# Altium schematic sheet Main.SchDoc
size A3; SheetNumber: 1; SheetTotal: 4
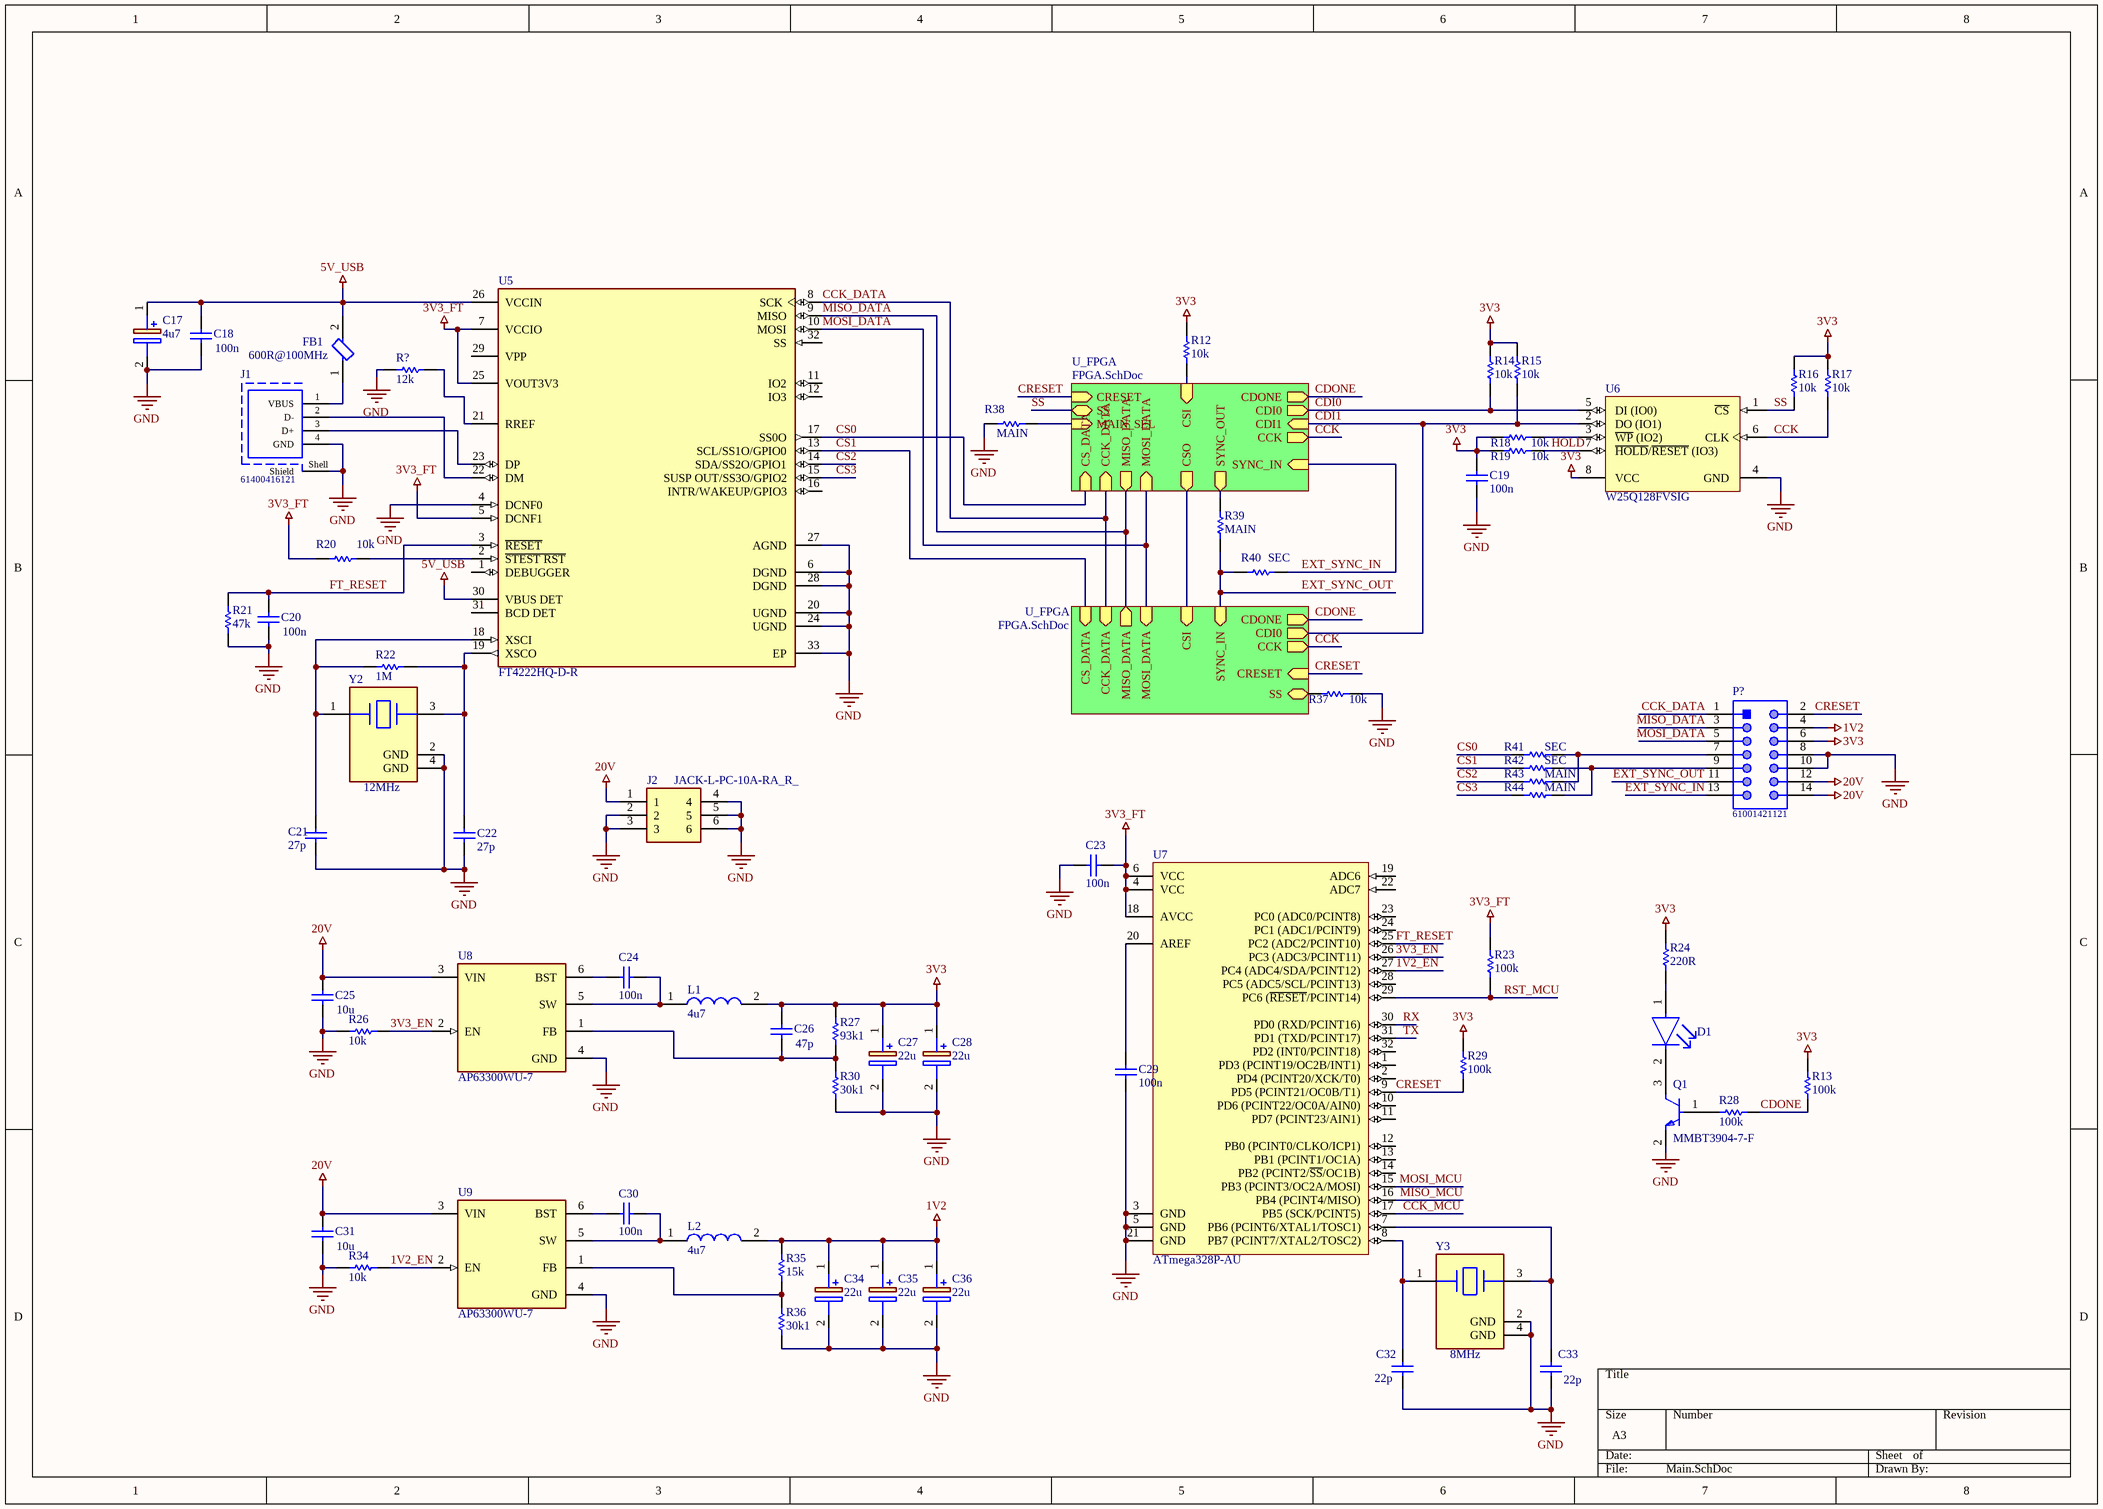
[diagram p0: Main.SchDoc]

## Parts
C17  4u7  [865080640004]
C18  100n  [SAMS-C0603-2_M]
C19  100n  [SAMS-C0603-2_M]
C20  100n  [SAMS-C0603-2_M]
C21  27p  [SAMS-C0603-2_M]
C22  27p  [SAMS-C0603-2_M]
C23  100n  [SAMS-C0603-2_M]
C24  100n  [SAMS-C0603-2_M]
C25  10u  [SAMS-C0603-2_M]
C26  47p  [SAMS-C0603-2_M]
C27  22u  [CAPAE430X550N]
C28  22u  [CAPAE430X550N]
C29  100n  [SAMS-C0603-2_M]
C30  100n  [SAMS-C0603-2_M]
C31  10u  [SAMS-C0603-2_M]
C32  22p  [SAMS-C0603-2_M]
C33  22p  [SAMS-C0603-2_M]
C34  22u  [CAPAE430X550N]
C35  22u  [CAPAE430X550N]
C36  22u  [CAPAE430X550N]
D1  (no value)  [FP-APT2012MGC-MFG]
FB1  600R@100MHz  [FP-MH1608-MFG]
J1  61400416121  [61400416121]
J2  JACK-L-PC-10A-RA_R_  [JACKLPC10ARAR]
L1  4u7  [SRP05204R7K]
L2  4u7  [SRP05204R7K]
P?  61001421121  [61001421121]
Q1  MMBT3904-7-F  [FP-SOT23-IPC_A]
R12  10k  [RESC1609X55X30LL15T15]
R13  100k  [RESC1609X55X30LL15T15]
R14  10k  [RESC1609X55X30LL15T15]
R15  10k  [RESC1609X55X30LL15T15]
R16  10k  [RESC1609X55X30LL15T15]
R17  10k  [RESC1609X55X30LL15T15]
R18  10k  [RESC1609X55X30LL15T15]
R19  10k  [RESC1609X55X30LL15T15]
R20  10k  [RESC1609X55X30LL15T15]
R21  47k  [RESC1609X55X30LL15T15]
R22  1M  [RESC1609X55X30LL15T15]
R23  100k  [RESC1609X55X30LL15T15]
R24  220R  [RESC1609X55X30LL15T15]
R26  10k  [RESC1609X55X30LL15T15]
R27  93k1  [RESC1609X55X30LL15T15]
R28  100k  [RESC1609X55X30LL15T15]
R29  100k  [RESC1609X55X30LL15T15]
R30  30k1  [RESC1609X55X30LL15T15]
R34  10k  [RESC1609X55X30LL15T15]
R35  15k  [RESC1609X55X30LL15T15]
R36  30k1  [RESC1609X55X30LL15T15]
R37  10k  [RESC1609X55X30LL15T15]
R38  MAIN  [RESC1005X40X20NL05T10]
R39  MAIN  [RESC1005X40X20NL05T10]
R40  SEC  [RESC1005X40X20NL05T10]
R41  SEC  [RESC1005X40X20NL05T10]
R42  SEC  [RESC1005X40X20NL05T10]
R43  MAIN  [RESC1005X40X20NL05T10]
R44  MAIN  [RESC1005X40X20NL05T10]
R?  12k  [RESC1609X55X30LL15T15]
U5  FT4222HQ-D-R  [FP-VQFN-32-MFG]
U6  W25Q128FVSIG  [WINB-SOIC-8_M]
U7  ATmega328P-AU  [32A_M]
U8  AP63300WU-7  [FP-TSOT26-IPC_A]
U9  AP63300WU-7  [FP-TSOT26-IPC_A]
Y2  12MHz  [FP-ABM3B-MFG]
Y3  8MHz  [FP-ABM3B-MFG]

## Sub-sheets
U_FPGA = FPGA.SchDoc: CDONE (out), CRESET (in), CDI1 (in), CDI0 (out), CCK (out), SS (bidir), MAIN_SEL (in), SYNC_OUT (out), SYNC_IN (in), CSI (in), CSO (out), CS_DATA (in), CCK_DATA (in), MISO_DATA (out), MOSI_DATA (in)
U_FPGA = FPGA.SchDoc: CDONE (out), CRESET (in), CDI0 (out), CCK (out), SS (bidir), SYNC_IN (in), CSI (in), MOSI_DATA (in), MISO_DATA (out), CCK_DATA (in), CS_DATA (in)

## Nets
1V2: C34.1(+) C35.1(+) C36.1(+) L2.2 P?.4 R35.2
3V3: C19.2 C26.1 C27.1(+) C28.1(+) L1.2 P?.6 R12.2 R13.1 R14.2 R15.2 R16.2 R17.2 R18.1 R19.1 R24.2 R27.2 R29.2 U6.8(VCC)
3V3_FT: C23.2 R20.1 R23.2 U5.5(DCNF1) U5.7(VCCIO) U5.25(VOUT3V3) U7.4(VCC) U7.6(VCC) U7.18(AVCC)
5V_USB: C17.1(+) C18.1 FB1.2 U5.26(VCCIN) U5.30(VBUS_DET)
20V: C25.1 C31.1 J2.1 P?.12 P?.14 U8.3(VIN) U9.3(VIN)
GND: C17.2(-) C18.2 C19.1 C20.2 C21.1 C22.1 C23.1 C25.2 C27.2(-) C28.2(-) C29.1 C31.2 C32.1 C33.1 C34.2(-) C35.2(-) C36.2(-) J1.4(GND) J1.Shell(Shield) J2.2 J2.3 J2.4 J2.5 J2.6 P?.8 P?.10 Q1.2(E) R21.1 R26.1 R30.1 R34.1 R36.1 R37.2 R38.2 R?.2 U5.4(DCNF0) U5.6(DGND) U5.20(UGND) U5.24(UGND) U5.27(AGND) U5.28(DGND) U5.33(EP) U6.4(GND) U7.3(GND) U7.5(GND) U7.21(GND) U8.4(GND) U9.4(GND) Y2.2(GND) Y2.4(GND) Y3.2(GND) Y3.4(GND)
1V2_EN: R34.2 U7.27(PC4_(ADC4/SDA/PCINT12)) U9.2(EN)
3V3_EN: R26.2 U7.26(PC3_(ADC3/PCINT11)) U8.2(EN)
CCK: R17.1 U6.6(CLK) ; sheet U_FPGA/CCK, sheet U_FPGA/CCK
CCK_DATA: P?.1 U5.8(SCK) ; sheet U_FPGA/CCK_DATA, sheet U_FPGA/CCK_DATA
CCK_MCU: U7.17(PB5_(SCK/PCINT5))
CDI0: R14.1 U6.5(DI_(IO0)) ; sheet U_FPGA/CDI0
CDI1: R15.1 U6.2(DO_(IO1)) ; sheet U_FPGA/CDI1, sheet U_FPGA/CDI0
CDONE: R13.2 R28.1 ; sheet U_FPGA/CDONE, sheet U_FPGA/CDONE
CRESET: P?.2 R29.1 U7.9(PD5_(PCINT21/OC0B/T1)) ; sheet U_FPGA/CRESET, sheet U_FPGA/CRESET
CS0: R41.2 U5.17(SS0O) ; sheet U_FPGA/CS_DATA
CS1: R42.2 U5.13(SCL/SS1O/GPIO0) ; sheet U_FPGA/CS_DATA
CS2: R43.2 U5.14(SDA/SS2O/GPIO1)
CS3: R44.2 U5.15(SUSP_OUT/SS3O/GPIO2)
EXT_SYNC_IN: P?.13 R40.1 ; sheet U_FPGA/SYNC_IN
EXT_SYNC_OUT: P?.11 R39.2 R40.2 ; sheet U_FPGA/SYNC_IN
FT_RESET: C20.1 R21.2 U5.3(~{RESET}) U7.25(PC2_(ADC2/PCINT10))
HOLD: R19.2 U6.7(~{HOLD}/~{RESET}_(IO3))
MISO_DATA: P?.3 U5.9(MISO) ; sheet U_FPGA/MISO_DATA, sheet U_FPGA/MISO_DATA
MISO_MCU: U7.16(PB4_(PCINT4/MISO))
MOSI_DATA: P?.5 U5.10(MOSI) ; sheet U_FPGA/MOSI_DATA, sheet U_FPGA/MOSI_DATA
MOSI_MCU: U7.15(PB3_(PCINT3/OC2A/MOSI))
RST_MCU: R23.1 U7.29(PC6_(~{RESET}/PCINT14))
RX: U7.30(PD0_(RXD/PCINT16))
SS: R16.1 U6.1(~{CS}) ; sheet U_FPGA/SS
TX: U7.31(PD1_(TXD/PCINT17))
NetC21_2: C21.2 R22.1 U5.18(XSCI) Y2.1
NetC22_2: C22.2 R22.2 U5.19(XSCO) Y2.3
NetC24_1: C24.1 U8.6(BST)
NetC24_2: C24.2 L1.1 U8.5(SW)
NetC26_2: C26.2 R27.1 R30.2 U8.1(FB)
NetC29_2: C29.2 U7.20(AREF)
NetC30_1: C30.1 U9.6(BST)
NetC30_2: C30.2 L2.1 U9.5(SW)
NetC32_2: C32.2 U7.8(PB7_(PCINT7/XTAL2/TOSC2)) Y3.1
NetC33_2: C33.2 U7.7(PB6_(PCINT6/XTAL1/TOSC1)) Y3.3
NetD1_1: D1.1(A) R24.1
NetD1_2: D1.2(C) Q1.3(C)
NetFB1_1: FB1.1 J1.1(VBUS)
NetJ1_2: J1.2(D-) U5.22(DM)
NetJ1_3: J1.3(D+) U5.23(DP)
NetP?_7: P?.7 R41.1 R43.1
NetP?_9: P?.9 R42.1 R44.1
NetQ1_1: Q1.1(B) R28.2
NetR12_1: R12.1 ; sheet U_FPGA/CSI
NetR18_2: R18.2 U6.3(~{WP}_(IO2))
NetR20_2: R20.2 U5.2(~{STEST_RST})
NetR35_1: R35.1 R36.2 U9.1(FB)
NetR37_1: R37.1 ; sheet U_FPGA/SS
NetR38_1: R38.1 ; sheet U_FPGA/MAIN_SEL
NetR39_1: R39.1 ; sheet U_FPGA/SYNC_OUT
NetR?_1: R?.1 U5.21(RREF)
(unnamed): sheet U_FPGA/CSO, sheet U_FPGA/CSI

Not connected (* = marked no-connect by the designer): U5 1(DEBUGGER) 11(IO2) 12(IO3) 16(INTR/WAKEUP/GPIO3) 29(VPP) 31(BCD_DET) 32(SS); U7 1(PD3_(PCINT19/OC2B/INT1)) 2(PD4_(PCINT20/XCK/T0)) 10(PD6_(PCINT22/OC0A/AIN0)) 11(PD7_(PCINT23/AIN1)) 12(PB0_(PCINT0/CLKO/ICP1)) 13(PB1_(PCINT1/OC1A)) 14(PB2_(PCINT2/~{SS}/OC1B)) 19(ADC6) 22(ADC7) 23(PC0_(ADC0/PCINT8)) 24(PC1_(ADC1/PCINT9)) 28(PC5_(ADC5/SCL/PCINT13)) 32(PD2_(INT0/PCINT18))

## Library data of the parts
C17 = 865080640004: Capacitor Polarised; Manufacturer_Name: Wurth Elektronik; Datasheet Link: https://www.we-online.de/katalog/datasheet/865080640004.pdf; Height: 5.5mm; Manufacturer_Part_Number: 865080640004; Mouser Part Number: 710-865080640004; Mouser Price/Stock: https://www.mouser.co.uk/ProductDetail/Wurth-Elektronik/865080640004?qs=0KOYDY2FL2%2FjY4kqBxIvAg%3D%3D
C18-C26 C29-C33 = CMP-2000-05332-1: Multi-layer Ceramic Capacitor, -55 to 125 degC, 2-Pin SMD (0603), RoHS, Tape and Reel; Manufacturer: Samsung Electro-Mechanics; Capacitance: 0.1µF; Rated Voltage: 50V; Dielectric: X7R; Tolerance (%): ±10%; Case Size/Dimension: 0603; Datasheet URL: https://datasheet.ciiva.com/29198/456651-da-01-en-vs-kondensator-0605-29198839.pdf; Manufacturer URL: http://www.samsungsem.com/global/index.jsp; Datasheet Version: Nov-10
C27 C28 C34-C36 = 865080340003: Capacitor Polarised; Manufacturer_Name: Wurth Elektronik; Datasheet Link: http://uk.rs-online.com/web/p/products/1635695; Height: 5.5mm; Manufacturer_Part_Number: 865080340003; Mouser Part Number: 710-865080340003; Mouser Price/Stock: https://www.mouser.co.uk/ProductDetail/Wurth-Elektronik/865080340003?qs=0KOYDY2FL2%252BowmC4S50IuQ%3D%3D
D1 = CMP-44529-000017-1: LED GREEN CLEAR CHIP SMD; Power Rating: 75mW; Lens Color: Colorless; Luminous Intensity: 70mcd; Forward Current: 20mA; Dominant Wavelength: 570nm; Viewing Angle: 120°; Forward Voltage: 2.1V; Package Quantity: 2000; Color: Green; Length: 2mm; Lead Free: Lead Free; Min Operating Temperature: -40°C; Illumination Color: Green; Case/Package: 0805; Width: 1.25mm; Test Current: 20mA; Max Operating Temperature: 85°C; Case Code (Imperial): 0805; Mount: Surface Mount; Lens Style: Clear; Height: 0.75mm; Case Code (Metric): 2012; Packaging: Tape and Reel; Lens Transparency: Clear
FB1 = CMP-2000-06698-2: FERRITE BEAD 600 OHM 0603 1LN; Tolerance: 25%; Max DC Current: 1A; Test Frequency: 100MHz; Current Rating: 3A; Number of Lines: 1; DC Resistance (DCR): 25mR; Impedance: 600R; Case/Package: 0603; Packaging: Tape and Reel; Case Code (Imperial): 0603; Radiation Hardening: No; Package Quantity: 1; Height: 0.039inch; Width: 0.031inch; Series: MH; REACH SVHC: No SVHC; Depth: 1mm; Min Operating Temperature: -55°C; Length: 0.063inch; Case Code (Metric): 1608; Termination: SMD/SMT; RoHS Compliant: Yes; DC Current: 1A; Max Current Rating: 1A; Core Material: Ferrite; Mount: Surface Mount; Military Standard: Not; Max Operating Temperature: 125°C
J1 = CMP-1502-03243-1: USB 2.0 Type B Receptacle WR-COM, Horizontal, THT, with Pads and Pegs; Manufacturer: Wurth Elektronik; Contact Resistance: 20mOhm; Rated Current: 1.5A; Working Voltage: 30VAC; Package Reference: 61400416121; Part Number: 61400416121; Packaging: Tray; Mounting Technology: THT; Gender: Receptacle; Datasheet URL: https://katalog.we-online.de/em/datasheet/61400416121.pdf; Publisher: WurthElektronik; Orientation: Horizontal; Connector Type: USB2.0TypeB; Operating Temperature: -40to105degC; Manufacturer URL: http://www.we-online.de
J2 = JACK-L-PC-10A-RA_R_: Connector; Manufacturer_Name: GlobTek; Manufacturer_Part_Number: JACK-L-PC-10A-RA(R); Datasheet Link: https://www.globtek.com/pdf/manual-datasheets/JACK-L-PC-10A-RA%28R%29.pdf; Height: 10mm
L1 L2 = SRP0520-4R7K: Inductor; Manufacturer_Name: Bourns; Datasheet Link: http://www.bourns.com/docs/Product-Datasheets/SRP0520.pdf; Height: 2mm; Manufacturer_Part_Number: SRP0520-4R7K; Mouser Part Number: 652-SRP0520-4R7K; Mouser Price/Stock: https://www.mouser.co.uk/ProductDetail/Bourns/SRP0520-4R7K?qs=OlC7AqGiEDkW8f66KV8wEw%3D%3D; Arrow Part Number: SRP0520-4R7K; Arrow Price/Stock: https://www.arrow.com/en/products/srp0520-4r7k/bourns?region=nac
P? = CMP-1502-01031-1: SMT Vertical Pin Header WR-PHD, Pitch 2.54 mm, Dual Row, 14 pins; Manufacturer: Wurth Elektronik; Withstanding Voltage: 500VAC; Working Voltage: 250VAC; Contact Resistance: 20mOhm; Pitch: 2.54mm; Rated Current: 3A; Gender: Male; Pin Number: 14; Datasheet URL: https://katalog.we-online.de/em/datasheet/6100xx21121.pdf; Operating Temperature: -40to125degC; Manufacturer URL: http://www.we-online.de; Mounting Technology: SMT; Publisher: WurthElektronik; Packaging: Tube; Orientation: Vertical; Row Number: Dual; Part Number: 61001421121; Package Reference: 61001421121
Q1 = CMP-2000-04931-2: TRANS NPN 40V 0.2A SMD SOT23-3; Frequency: 300MHz; Power Dissipation: 350mW; Element Configuration: Single; Max Power Dissipation: 300mW; Max Collector Current: 200mA; Collector Emitter Saturation Voltage: 300mV; Number of Elements: 1; hFE Min: 100; Collector Base Voltage (VCBO): 60V; Emitter Base Voltage (VEBO): 6V; Contact Plating: Tin; Package Quantity: 3000; Max Frequency: 300MHz; REACH SVHC: No SVHC; Max Operating Temperature: 150°C; Width: 1.4mm; Collector Emitter Voltage (VCEO): 40V; Voltage Rating (DC): 40V; Radiation Hardening: No; Case/Package: SOT-23; Height: 1mm; Collector Emitter Breakdown Voltage: 40V; Length: 3.05mm; Polarity: NPN; Packaging: Tape and Reel; Number of Pins: 3; Min Operating Temperature: -55°C; Gain Bandwidth Product: 300MHz; Mount: Surface Mount; Weight: 0.000282oz; Continuous Collector Current: 200mA; Transition Frequency: 300MHz; Max Breakdown Voltage: 40V; Lead Free: Lead Free
R12-R24 R26-R30 R34-R37 R? = CMP-1012-00623-3: Chip Resistor, 10 KOhm, +/- 1%, 0.1 W, -55 to 155 degC, 0603 (1608 Metric), RoHS, Tape and Reel; Manufacturer: Panasonic; Voltage Rating: 75V; Case\/Package: 0603; Power Rating: 100mW; Resistance: 10KOhm; Temperature Coefficient: 100ppm\/degreesC; Number of Pins: 2; Package Reference: 603; Depth: 0.8mm; Mount: SurfaceMount; Package Description: 2-Pin Surface Mount Device, Body 1.6 x 0.85 mm; Datasheet Version: 02/2017; Length: 1.6mm; Lead Free: LeadFree; Height: 0.45mm; Number of Terminations: 2; Max Power Dissipation: 100mW; Min Operating Temperature: -55degC; Datasheet URL: https://industrial.panasonic.com/cdbs/www-data/pdf/RDA0000/AOA0000C304.pdf; Termination: SMD/SMT; Case Code (Metric): 1608; Case Code (Imperial): 0603; Tolerance: 1%; Max Operating Temperature: 155degC; RoHSCompliant: true; Voltage Rating (DC): 75V; Radiation Hardening: No; Packaging: TapeandReel; Composition: ThickFilm; Mounting Technology: SurfaceMount; Manufacturer URL: http://www.panasonic.com/; Width: 0.031inch; REACH SVHC: NoSVHC; Contact Plating: Tin; Military Standard: Not; Package Quantity: 1
R38-R44 = CMP-2002-01682-1: Manufacturer: Vishay BCcomponents; Part Number: TNPW040210K0DEED
U5 = CMP-194822-000008-1: IC BRIDGE USB TO I2C/SPI 32VQFN; Interface: I2C; Operating Supply Current: 78mA; Case/Package: VQFN; Max Operating Temperature: 85°C; Min Operating Temperature: -40°C; Packaging: Tape and Reel
U6 = CMP-2000-05005-1: 3V 128M-Bit Serial Flash Memory with Dual/Quad SPI & QPI, 2.7 to 3.6 V, -40 to 85 degC, 8-Pin SOIC, RoHS, Tape and Reel; Manufacturer: Winbond; Number of Words: 16777216; Address Bus: 24b; Word Size: 8b; Boot Type: NotRequired; Supply Current: 20mA; Operating Supply Voltage (Max): 3.6V; Sync/Async: Synchronous; Rad Hardened: No; Interface Type: Serial(SPI); Access Time (Max): 7ns; Operating Supply Voltage (Min): 2.7V; Operating Supply Voltage (Typ): 3/3.3V; Programmable: Yes; Density: 134217728Bit; Cell Type: NOR; Package Description: 8-Pin Small Outline Integrated Circuit, Body 5.28 x 5.28 mm, Pitch 1.27 mm; Datasheet URL: http://download.siliconexpert.com/pdfs/2015/11/30/6/42/17/890/win_/manual/3w25q128fv20rev.l2008242015.pdf; Package Reference: SS-8; Package Type: SOICW; Datasheet Version: Rev. L, 08/2015; Manufacturer URL: http://www.winbond.com/hq/index.html?__locale=en; Pin Count: 8; Operating Temperature Classification: Industrial; Operating Temperature (Min): -40C; Program/Erase Volt (Typ): 2.7to3.6V; Operating Temperature (Max): 85C; Mounting: SurfaceMount; Operating Temp Range: -40Cto85C
U7 = CMP-0095-00269-2: 8-bit AVR Microcontroller, 32KB Flash, 1KB EEPROM, 2KB SRAM, 32-pin TQFP, Industrial Grade (-40°C to 85°C); PackageDescription: 32-Lead, 7x7x1.0 mm Body, 0.8mm Lead Pitch, Thin Profile Plastic Quad Flat Package (TQFP); DatasheetVersion: revD, May-2011; RevisionNote: DatasheetVersion & PackageVersion updated. URLs added.; ComponentLink1URL: http://www.atmel.com/; ComponentLink2Description: ATmega48A/48PA/88A/88PA/168A/168PA/328/328P Datasheet; Code_JEDEC: MS-026-ABA; ComponentLink1Description: Manufacturer URL; PackageReference: 32A; ComponentLink3Description: ATmega48A/48PA/88A/88PA/168A/168PA/328/328P Summary; ComponentLink2URL: http://www.atmel.com/dyn/resources/prod_documents/doc8271.pdf; PackageVersion: revC, Oct-2010; ComponentLink3URL: http://www.atmel.com/dyn/resources/prod_documents/8271S.pdf
U8 U9 = CMP-12757-000025-1: DCDC CONV HV BUCK TSOT26
Y2 = CMP-1688-00007-2: Crystal 12MHz ±20ppm 18pF SMD-4 5mm x 3.2mm; Series Resistance: 70R; Frequency Stability: 50ppm; REACH SVHC: No SVHC; Package Quantity: 1000; Min Operating Temperature: -20°C; Mount: Surface Mount; Frequency: 12MHz; Length: 5mm; Termination: SMD/SMT; Load Capacitance: 18pF; Lead Free: Lead Free; Case/Package: CSMD; Number of Pins: 4; Max Operating Temperature: 70°C; Height: 0.043inch; Radiation Hardening: No; Series: ABM3B; Operating Frequency: 12 MHz; Depth: 3.2mm; Tolerance: 20ppm; ESR (Equivalent Series Resistance): 70R; Width: 0.126inch; Resistor Type: Ceramic; Frequency Tolerance: 20ppm; Packaging: Tape and Reel
Y3 = CMP-1688-00002-2: Crystal 8MHz ±20ppm 18pF SMD-4 5mm x 3.2mm; ESR (Equivalent Series Resistance): 200R; Frequency Stability: 50ppm; Operating Frequency: 8 MHz; Mount: Surface Mount; Number of Pins: 4; Packaging: Tape and Reel; Width: 0.126inch; Case/Package: CSMD; Lead Free: Lead Free; Depth: 3.2mm; Load Capacitance: 18pF; Min Operating Temperature: -20°C; Series: ABM3B; Package Quantity: 1000; Resistor Type: Ceramic; Height: 0.043inch; Max Operating Temperature: 70°C; Frequency Tolerance: 20ppm; Series Resistance: 200R; Tolerance: 20ppm; Termination: SMD/SMT; Length: 5mm; Frequency: 8MHz